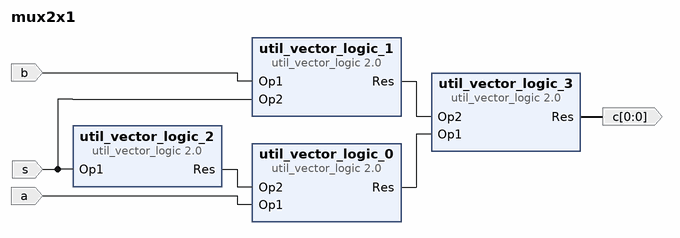
[diagram p0: block diagram of the top level]
# Vivado block design mux2x1, xc7a100tfgg484-1, Vivado 2019.2
create_bd_design mux2x1

create_bd_port -dir I a
create_bd_port -dir I b
create_bd_port -dir O -from 0 -to 0 c
create_bd_port -dir I s

create_bd_cell -type ip -vlnv xilinx.com:ip:util_vector_logic:2.0 util_vector_logic_0
set_property -dict {CONFIG.C_OPERATION and CONFIG.C_SIZE 1} [get_bd_cells util_vector_logic_0]
create_bd_cell -type ip -vlnv xilinx.com:ip:util_vector_logic:2.0 util_vector_logic_1
set_property -dict {CONFIG.C_SIZE 1} [get_bd_cells util_vector_logic_1]
create_bd_cell -type ip -vlnv xilinx.com:ip:util_vector_logic:2.0 util_vector_logic_2
set_property -dict {CONFIG.C_OPERATION not CONFIG.C_SIZE 1} [get_bd_cells util_vector_logic_2]
create_bd_cell -type ip -vlnv xilinx.com:ip:util_vector_logic:2.0 util_vector_logic_3
set_property -dict {CONFIG.C_OPERATION or CONFIG.C_SIZE 1} [get_bd_cells util_vector_logic_3]

# ---- connections ----

connect_bd_net [get_bd_pins util_vector_logic_3/Res] [get_bd_ports c]
connect_bd_net [get_bd_pins util_vector_logic_0/Res] [get_bd_pins util_vector_logic_3/Op1]
connect_bd_net [get_bd_pins util_vector_logic_1/Res] [get_bd_pins util_vector_logic_3/Op2]
connect_bd_net [get_bd_ports s] [get_bd_pins util_vector_logic_2/Op1] [get_bd_pins util_vector_logic_1/Op2]
connect_bd_net [get_bd_pins util_vector_logic_2/Res] [get_bd_pins util_vector_logic_0/Op2]
connect_bd_net [get_bd_ports a] [get_bd_pins util_vector_logic_0/Op1]
connect_bd_net [get_bd_ports b] [get_bd_pins util_vector_logic_1/Op1]

validate_bd_design
save_bd_design
